# EAGLE board scheda principale c&i copia (EAGLE 9.6.2), part 1 of 2
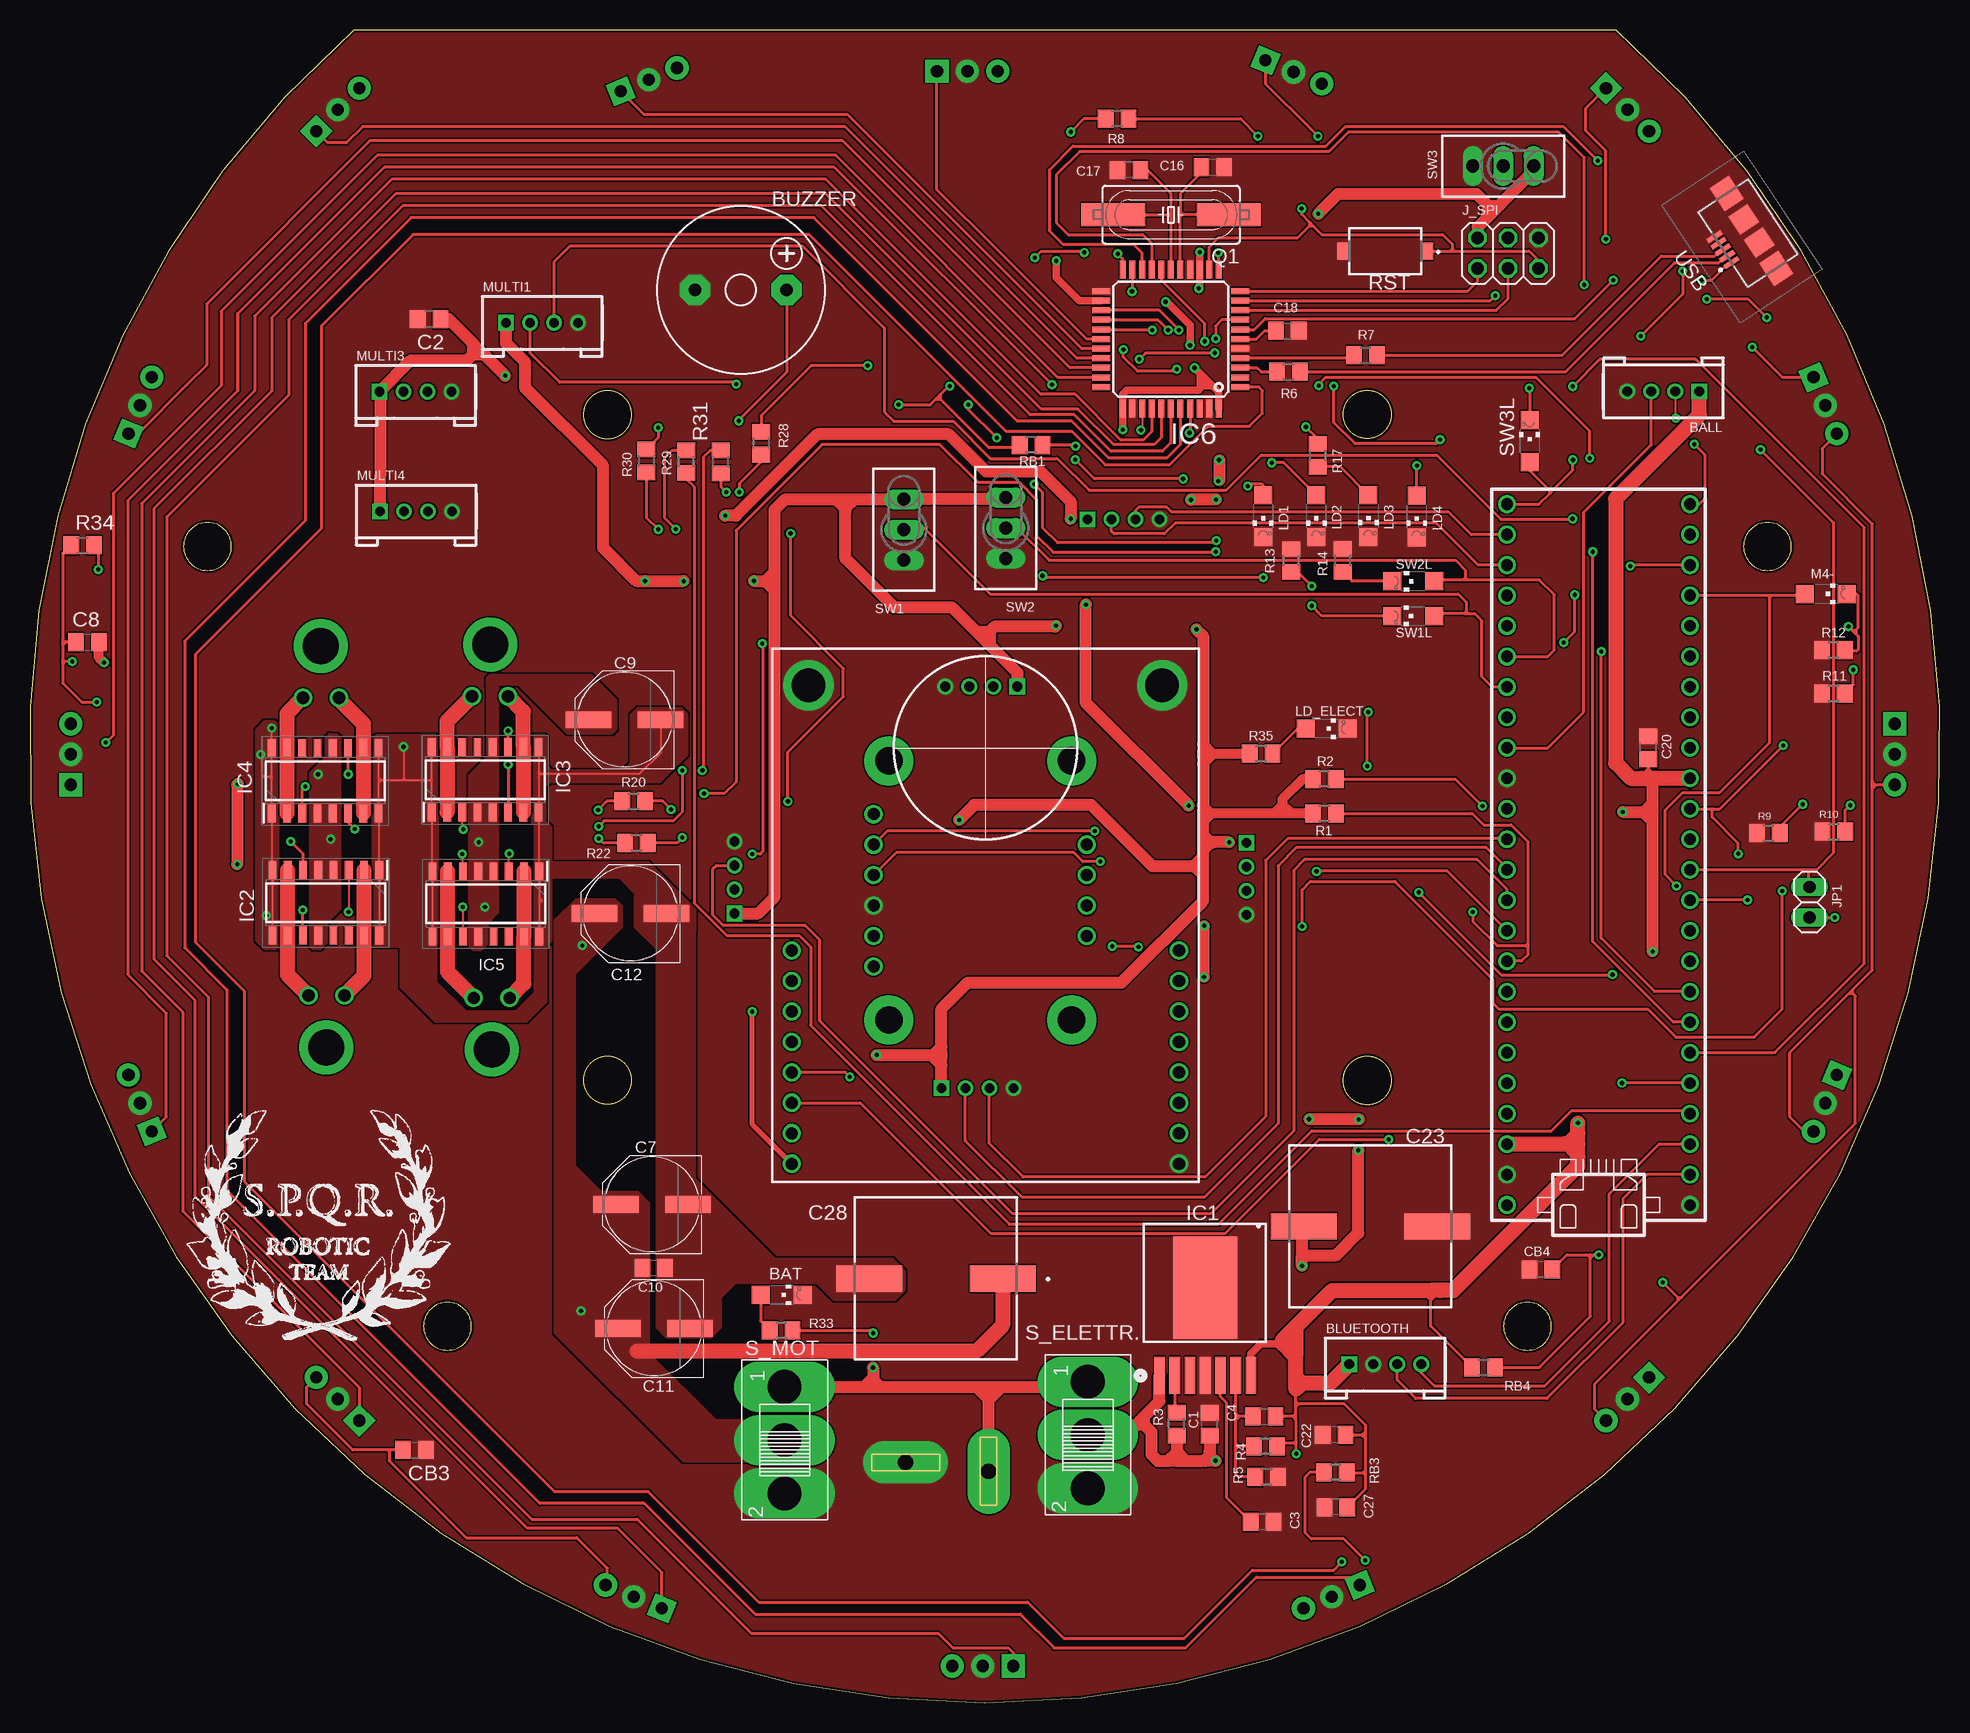
[diagram p1: board, top side]
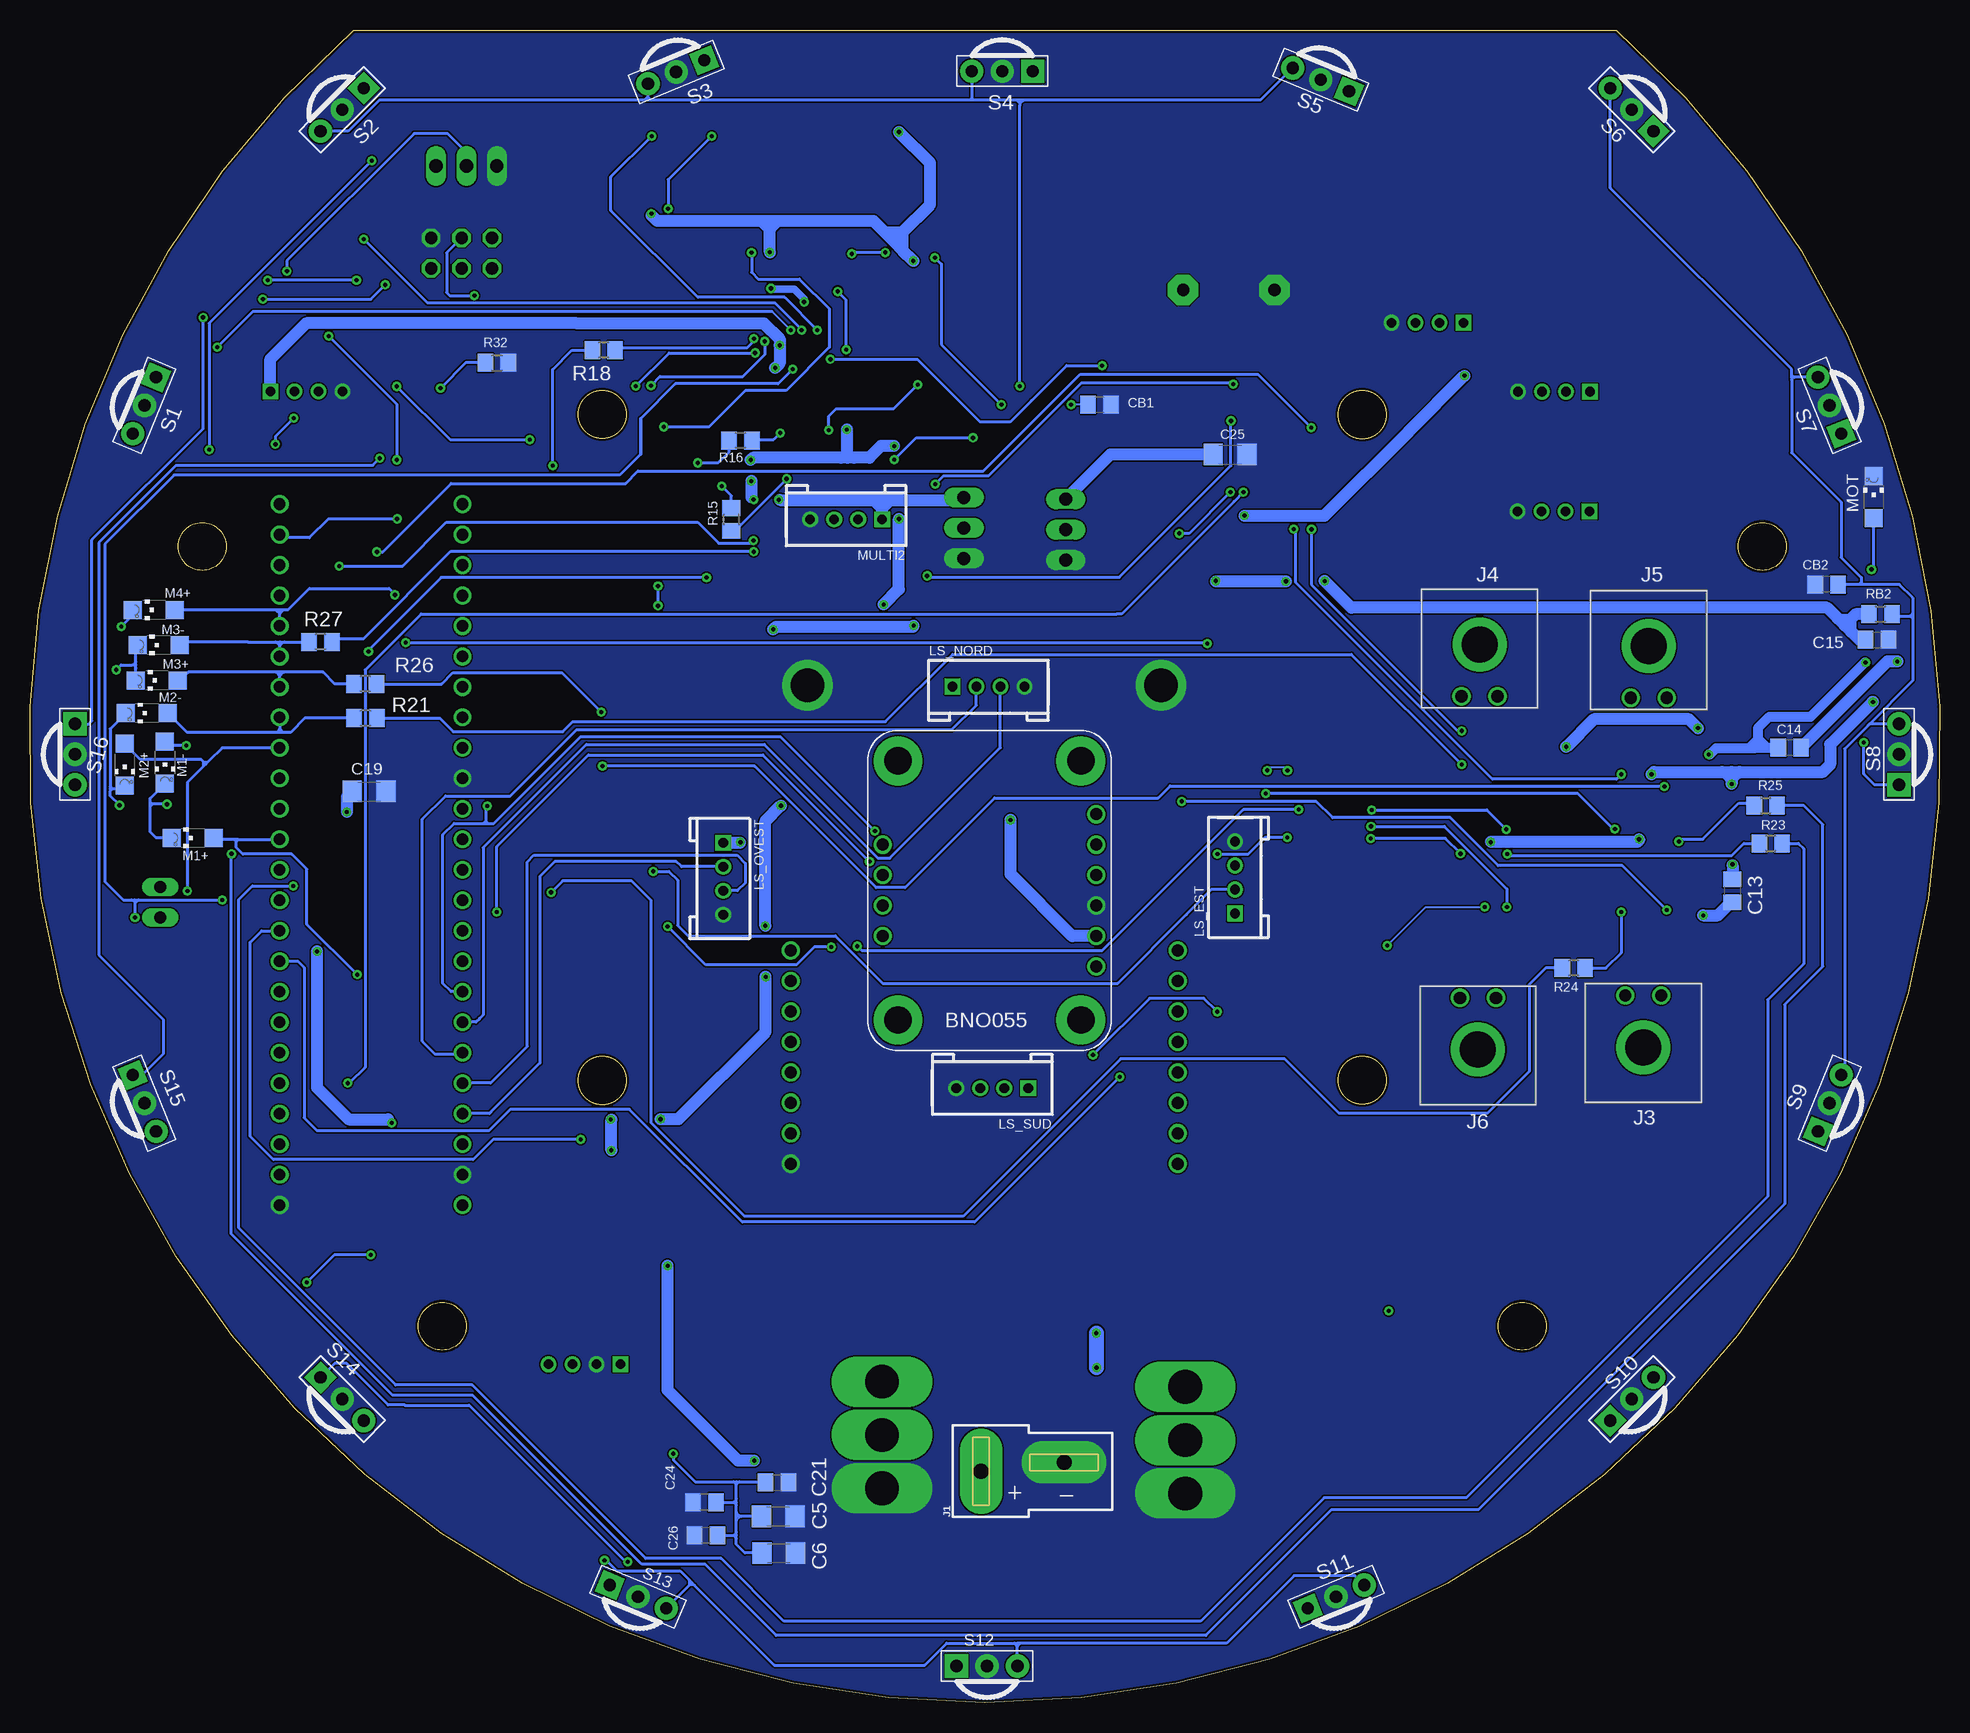
[diagram p2: board, bottom side, seen from below]

Size 159.14 x 139.44 mm. Coordinates in mm from the lower left corner, seen from the top.
Outline: 26.97,139.44 arc277 132.17,139.44 26.97,139.44
Outline: 124.79,29.39 arc180 124.79,33.39 arc180 124.79,29.39
Outline: 34.79,29.39 arc180 34.79,33.39 arc180 34.79,29.39
Outline: 14.79,94.39 arc180 14.79,98.39 arc180 14.79,94.39
Outline: 144.79,94.39 arc180 144.79,98.39 arc180 144.79,94.39
Outline: circle at 111.45,107.39 radius 2
Outline: circle at 111.45,51.89 radius 2
Outline: circle at 48.13,51.9 radius 2
Outline: circle at 48.13,107.39 radius 2
Copper layers (1*16): Top 0.035mm / dielectric 1.6mm / Bottom 0.035mm
Design rules "jlcpcb-2layers *": minimum track width 5mil, minimum drill 0.3mm, track to track 5mil, track to pad 5mil, pad to pad 5mil, via to via 5mil, smd to smd 5mil, copper to edge 0.2mm, drill to drill 6mil, minimum pad ring 10mil, minimum via ring 8mil, stop-mask expansion 4mil, vias tented up to drill 0mil, thermal gap 10mil

## Footprints (pad centres in the part's own frame; a part is rotated, then mirrored left to right if it is on the bottom)
2.0_1X4 = drill 0.8 pad 1.27 square: 1 -3,0 | drill 0.8 pad 1.27: 2 -1,0; 3 1,0; 4 3,0
CHIPLED_1206 = smd 1.5 x 1.5: A 0,-1.75; C 0,1.75
F/CM12P = drill 1.016 pad 2.54 octagon: + 3.81,0; - -3.81,0
C0805 = smd 1.3 x 1.5: 1 -0.95,0; 2 0.95,0
C1206 = smd 1.6 x 1.8: 1 -1.4,0; 2 1.4,0
PANASONIC_E = smd 3.8 x 1.4: + 3,0; - -3,0
FKV(H13) = smd 5.5 x 2.2: 1 -5.55,0; 2 5.55,0
NDW0007A = smd 0.89 x 3.06: 1 -3.81,0; 2 -2.54,0; 3 -1.27,0; 4 0,0; 5 1.27,0; 6 2.54,0; 7 3.81,0 | smd 5.35 x 8.54: 8 0,7.305
SOIC127P600X175-16N = smd 1.525 x 0.65: 1 -2.712,4.445; 2 -2.712,3.175; 3 -2.712,1.905; 4 -2.712,0.635; 5 -2.712,-0.635; 6 -2.712,-1.905; 7 -2.712,-3.175; 8 -2.712,-4.445; 9 2.712,-4.445; 10 2.712,-3.175; 11 2.712,-1.905; 12 2.712,-0.635; 13 2.712,0.635; 14 2.712,1.905; 15 2.712,3.175; 16 2.712,4.445
TQFP44 = smd 1.5 x 0.5: 1 -5.8,4; 2 -5.8,3.2; 3 -5.8,2.4; 4 -5.8,1.6; 5 -5.8,0.8; 6 -5.8,0; 7 -5.8,-0.8; 8 -5.8,-1.6; 9 -5.8,-2.4; 10 -5.8,-3.2; 11 -5.8,-4; 23 5.8,-4; 24 5.8,-3.2; 25 5.8,-2.4; 26 5.8,-1.6; 27 5.8,-0.8; 28 5.8,0; 29 5.8,0.8; 30 5.8,1.6; 31 5.8,2.4; 32 5.8,3.2; 33 5.8,4 | smd 0.5 x 1.5: 12 -4,-5.8; 13 -3.2,-5.8; 14 -2.4,-5.8; 15 -1.6,-5.8; 16 -0.8,-5.8; 17 0,-5.8; 18 0.8,-5.8; 19 1.6,-5.8; 20 2.4,-5.8; 21 3.2,-5.8; 22 4,-5.8; 34 4,5.8; 35 3.2,5.8; 36 2.4,5.8; 37 1.6,5.8; 38 0.8,5.8; 39 0,5.8; 40 -0.8,5.8; 41 -1.6,5.8; 42 -2.4,5.8; 43 -3.2,5.8; 44 -4,5.8
DEANS = drill 1.27 pad 3.556 long: + 0,0; - 0.737,-6.921
43650-0200 = drill 1.02 pad 1.52: 1 0,0; 2 -3,0 | drill 3 pad 3: 3 -1.5,-4.32
2X03 = drill 1.016 octagon: 1 -2.54,-1.27; 2 -2.54,1.27; 3 0,-1.27; 4 0,1.27; 5 2.54,-1.27; 6 2.54,1.27
1X02 = drill 1.016 long: 1 -1.27,0; 2 1.27,0
HC49UP = smd 5.334 x 1.93: 1 -4.826,0; 2 4.826,0
R0805 = smd 1.3 x 1.5: 1 -0.95,0; 2 0.95,0
KSR = smd 1 x 1.4: 1 -3.5,0; 2 3.5,0
PNA460XM = drill 1.016 pad 1.93 square: 1 -2.54,0 | drill 1.016 pad 1.93: 2 0,0; 3 2.54,0
255SB = drill 2.8 pad 3.048 long: 1 2.667,3.556; 2 7.112,3.556; 3 11.557,3.556
TL3XPO = drill 1.1 pad 1.422 long: 1 -2.54,0; 2 0,0; 3 2.54,0
TEENSY_3.5/3.6 = drill 0.965: 0/RX -25.4,-7.62; 1/TX -22.86,-7.62; 2 -20.32,-7.62; 3/CANTX -17.78,-7.62; 3V3 7.62,-7.62; 3V3_LO -22.86,7.62; 4/CANRX -15.24,-7.62; 5 -12.7,-7.62; 6 -10.16,-7.62; 7 -7.62,-7.62; 8 -5.08,-7.62; 9/CS -2.54,-7.62; 10/CS 0,-7.62; 11/MOSI 2.54,-7.62; 12/MISO 5.08,-7.62; 13/SCK 5.08,7.62; 14/A0 2.54,7.62; 15/A1 0,7.62; 16/A2 -2.54,7.62; 17/A3 -5.08,7.62; 18/A4/SDA -7.62,7.62; 19/A5/SCL -10.16,7.62; 20/A6 -12.7,7.62; 21/A7 -15.24,7.62; 21/DAC0 12.7,7.62; 22/A8 -17.78,7.62; 23/A9 -20.32,7.62; 24 10.16,-7.62; 25 12.7,-7.62; 26 15.24,-7.62; 27 17.78,-7.62; 28 20.32,-7.62; 29 22.86,-7.62; 30 25.4,-7.62; 31/A12 27.94,-7.62; 32/A13 30.48,-7.62; 33/A14 30.48,7.62; 34/A15 27.94,7.62; 35/A16 25.4,7.62; 36/A17 22.86,7.62; 37/A18 20.32,7.62; 38/A19 17.78,7.62; 39/A20 15.24,7.62; A22/DAC1 10.16,7.62; AGND -25.4,7.62; GND -27.94,-7.62; GND2 7.62,7.62; VIN -27.94,7.62
OPENMV_H7 = drill 1.016: 3V3 1.651,1.524; BOOT 33.909,16.764; GND 33.909,1.524; P0 1.651,19.304; P1 1.651,16.764; P2 1.651,14.224; P3 1.651,11.684; P4 1.651,9.144; P5 1.651,6.604; P6 1.651,4.064; P7 33.909,6.604; P8 33.909,9.144; P9 33.909,11.684; RST 33.909,19.304; SYNC 33.909,14.224; VIN 33.909,4.064 | drill 2.794 pad 3.81: PAD1 3.048,41.402 | drill 2.794: PAD2 32.512,41.402
BNO055 = drill 1: 3V3 9.525,1.27; ADR 17.145,19.05; GND 12.065,1.27; INT 14.605,19.05; PS0 9.525,19.05; PS1 12.065,19.05; RST 19.685,1.27; SCL 17.145,1.27; SDA 14.605,1.27; VIN 6.985,1.27 | drill 2.286 pad 4.064: PAD@1 2.54,17.78; PAD@2 24.13,17.78; PAD@3 2.54,2.54; PAD@4 24.13,2.54
101041110001LF = smd 0.4 x 1.4: 1 -1.3,5; 2 -0.65,5; 3 0,5; 4 0.65,5; 5 1.3,5 | smd 2.3 x 1.9: 6 -3.75,2.15; 7 3.75,2.15 | smd 1.8 x 1.9: 8 -1.15,2.15; 9 1.15,2.15

## Placement (x,y rotation side)
BALL  TWIG_2.0  [2.0_1X4]  136.11,109.31 180 top
BAT  [CHIPLED_1206]  62.65,34.01 270 top
BLUETOOTH  TWIG_2.0  [2.0_1X4]  112.94,28.22 0 top
BUZZER  F/CM12P  [F/CM12P]  59.23,117.77 0 top
C1  100n  [C0805]  98.3,23.22 90 top
C2  100n  [C0805]  33.27,115.35 180 top
C3  22n  [C0805]  102.68,15.1 0 top
C4  22n  [C0805]  102.85,23.86 0 top
C5  100u  [C1206]  96.78,15.54 0 bottom
C6  100u  [C1206]  96.74,12.49 0 bottom
C7  1OOu  [PANASONIC_E]  51.83,41.54 180 top
C8  1u  [C0805]  4.8,88.42 0 top
C9  100u  [PANASONIC_E]  49.54,81.94 180 top
C10  1u  [C0805]  51.98,36.27 0 top
C11  100u  [PANASONIC_E]  52.01,31.21 180 top
C12  100u  [PANASONIC_E]  50.05,65.78 180 top
C13  1u  [C0805]  17.3,67.7 270 bottom
C14  1u  [C0805]  12.5,79.61 180 bottom
C15  1u  [C0805]  5.22,88.61 0 bottom
C16  1u  [C0805]  98.56,128 0 top
C17  1u  [C0805]  91.58,127.77 180 top
C18  1u  [C0805]  104.78,114.36 0 top
C19  1u  [C1206]  130.87,75.97 0 bottom
C20  1u  [C0805]  134.87,79.62 90 top
C21  1u  [C0805]  96.89,18.36 0 bottom
C22  100n  [C0805]  108.68,22.35 180 top
C23  EEV-FK1C152Q  [FKV(H13)]  111.71,39.71 0 top
C24  100n  [C0805]  102.94,16.71 180 bottom
C25  100n  [C1206]  59.13,104.06 0 bottom
C26  1u  [C0805]  102.81,13.94 180 bottom
C27  100n  [C0805]  108.82,16.31 180 top
C28  EEV-FK1C152Q  [FKV(H13)]  75.5,35.36 180 top
CB1  0.1uF  [C0805]  70.02,108.23 0 bottom
CB2  0.1uF  [C0805]  9.42,93.23 180 bottom
CB3  0.1uF  [C0805]  32.03,21.07 0 top
CB4  0.1uF  [C0805]  125.9,36.11 180 top
IC1  LMZ14202TZE-ADJ_NOPB  [NDW0007A]  97.93,27.29 0 top
IC2  VNH7070ASTR  [SOIC127P600X175-16N]  24.65,66.69 270 top
IC3  VNH7070ASTR  [SOIC127P600X175-16N]  37.93,76.94 90 top
IC4  VNH7070ASTR  [SOIC127P600X175-16N]  24.6,76.87 90 top
IC5  VNH7070ASTR  [SOIC127P600X175-16N]  37.99,66.59 270 top
IC6  ATMEGA32U4-AU  [TQFP44]  95.07,113.68 180 top
J1  [DEANS]  79.88,19.3 90 bottom
J3  43650-0201  [43650-0200]  23.2,58.96 0 bottom
J4  43650-0201  [43650-0200]  39.84,83.91 180 bottom
J5  43650-0201  [43650-0200]  25.74,83.78 180 bottom
J6  43650-0201  [43650-0200]  36.97,58.76 0 bottom
J_SPI  [2X03]  123.17,120.84 0 top
JP1  [1X02]  148.29,66.73 270 top
LD1  [CHIPLED_1206]  102.76,98.92 180 top
LD2  [CHIPLED_1206]  107.2,98.91 180 top
LD3  [CHIPLED_1206]  111.54,98.93 180 top
LD4  [CHIPLED_1206]  115.56,98.89 180 top
LD_ELECT  [CHIPLED_1206]  108.05,81.2 270 top
LS_EST  TWIG_2.0  [2.0_1X4]  58.71,68.8 90 bottom
LS_NORD  TWIG_2.0  [2.0_1X4]  79.27,84.71 0 bottom
LS_OVEST  TWIG_2.0  [2.0_1X4]  101.37,68.7 270 bottom
LS_SUD  TWIG_2.0  [2.0_1X4]  78.95,51.24 180 bottom
M1+  [CHIPLED_1206]  145.58,72.1 90 bottom
M1-  [CHIPLED_1206]  147.89,78.38 180 bottom
M2+  [CHIPLED_1206]  151.25,78.19 180 bottom
M2-  [CHIPLED_1206]  149.4,82.5 90 bottom
M3+  [CHIPLED_1206]  148.56,85.23 90 bottom
M3-  [CHIPLED_1206]  148.41,88.18 90 bottom
M4+  [CHIPLED_1206]  148.81,91.1 90 bottom
M4-  [CHIPLED_1206]  149.66,92.44 270 top
MOT  [CHIPLED_1206]  5.5,100.51 0 bottom
MULTI1  TWIG_2.0  [2.0_1X4]  42.68,115.04 0 top
MULTI2  TWIG_2.0  [2.0_1X4]  91.12,98.64 180 bottom
MULTI3  TWIG_2.0  [2.0_1X4]  32.14,109.29 0 top
MULTI4  TWIG_2.0  [2.0_1X4]  32.18,99.32 0 top
Q1  [HC49UP]  95.09,124.03 180 top
R1  10k  [R0805]  107.88,74.13 180 top
R2  10k  [R0805]  107.86,76.99 180 top
R3  61,9k  [R0805]  95.54,23.24 90 top
R4  3,32k  [R0805]  102.96,21.37 180 top
R5  1,07k  [R0805]  103.05,18.82 180 top
R6  [R0805]  104.88,110.94 0 top
R7  [R0805]  111.29,112.34 0 top
R8  10k  [R0805]  90.59,132.05 180 top
R9  [R0805]  144.87,72.5 0 top
R10  [R0805]  150.32,72.61 0 top
R11  [R0805]  150.28,84.14 0 top
R12  [R0805]  150.28,87.77 0 top
R13  [R0805]  105.1,95.21 90 top
R14  [R0805]  109.4,95.22 90 top
R15  [R0805]  100.69,98.64 90 bottom
R16  [R0805]  99.94,105.22 180 bottom
R17  [R0805]  107.3,103.99 270 top
R18  [R0805]  111.33,112.75 180 bottom
R20  [R0805]  50.3,75.16 0 top
R21  [R0805]  131.18,82.07 180 bottom
R22  [R0805]  50.53,71.69 0 top
R23  [R0805]  14.08,71.64 0 bottom
R24  [R0805]  30.5,61.26 180 bottom
R25  [R0805]  14.5,74.8 0 bottom
R26  [R0805]  131.2,84.94 180 bottom
R27  [R0805]  134.93,88.44 180 bottom
R28  [R0805]  60.92,105 270 top
R29  [R0805]  54.69,103.46 90 top
R30  [R0805]  51.36,103.52 270 top
R31  [R0805]  57.57,103.45 90 top
R32  [R0805]  120.23,111.7 0 bottom
R33  [R0805]  62.6,31.05 180 top
R34  [R0805]  4.39,96.49 0 top
R35  [R0805]  102.59,79.11 180 top
RB1  22  [R0805]  83.43,104.85 180 top
RB2  22  [R0805]  4.93,90.75 0 bottom
RB3  22  [R0805]  108.78,19.2 180 top
RB4  22  [R0805]  121.12,27.96 0 top
RST  KSR231GLFS  [KSR]  112.94,121.01 180 top
S1  PNA460XM  [PNA460XM]  149.6,108.15 247.5 bottom
S2  PNA460XM  [PNA460XM]  133.13,132.8 225 bottom
S3  PNA460XM  [PNA460XM]  105.3,135.94 202.5 bottom
S4  PNA460XM  [PNA460XM]  78.12,136.01 180 bottom
S5  PNA460XM  [PNA460XM]  51.57,135.31 157.5 bottom
S6  PNA460XM  [PNA460XM]  25.65,132.8 135 bottom
S7  PNA460XM  [PNA460XM]  9.17,108.15 112.5 bottom
S8  PNA460XM  [PNA460XM]  3.39,79.06 90 bottom
S9  PNA460XM  [PNA460XM]  9.17,49.98 67.5 bottom
S10  PNA460XM  [PNA460XM]  25.65,25.32 45 bottom
S11  PNA460XM  [PNA460XM]  50.3,8.85 22.5 bottom
S12  PNA460XM  [PNA460XM]  79.39,3.06 0 bottom
S13  PNA460XM  [PNA460XM]  108.47,8.85 337.5 bottom
S14  PNA460XM  [PNA460XM]  133.13,25.32 315 bottom
S15  PNA460XM  [PNA460XM]  149.6,49.98 292.5 bottom
S16  PNA460XM  [PNA460XM]  155.39,79.06 270 bottom
S_ELETTR.  [255SB]  84.59,29.44 270 top
S_MOT  [255SB]  59.31,29 270 top
SW1  TL38PO  [TL3XPO]  72.82,97.79 270 top
SW1L  [CHIPLED_1206]  115.26,90.59 90 top
SW2  TL38PO  [TL3XPO]  81.32,97.93 270 top
SW2L  [CHIPLED_1206]  115.27,93.49 90 top
SW3  TL38PO  [TL3XPO]  122.77,128.1 180 top
SW3L  [CHIPLED_1206]  124.97,105.17 0 top
U$1  TEENSY_3.5/3.6  [TEENSY_3.5/3.6]  130.71,69.44 90 top
U$2  OPENMV_H7  [OPENMV_H7]  61.83,43.41 0 top
U$4  BNO055  [BNO055]  69.03,54.38 90 bottom
USB  10104111-0001LF  [101041110001LF]  145.25,123.88 123.5 top